# EAGLE design mcp23008_io_wing (EAGLE 9.6.0)
AUTHOR: Göran Mannnberg
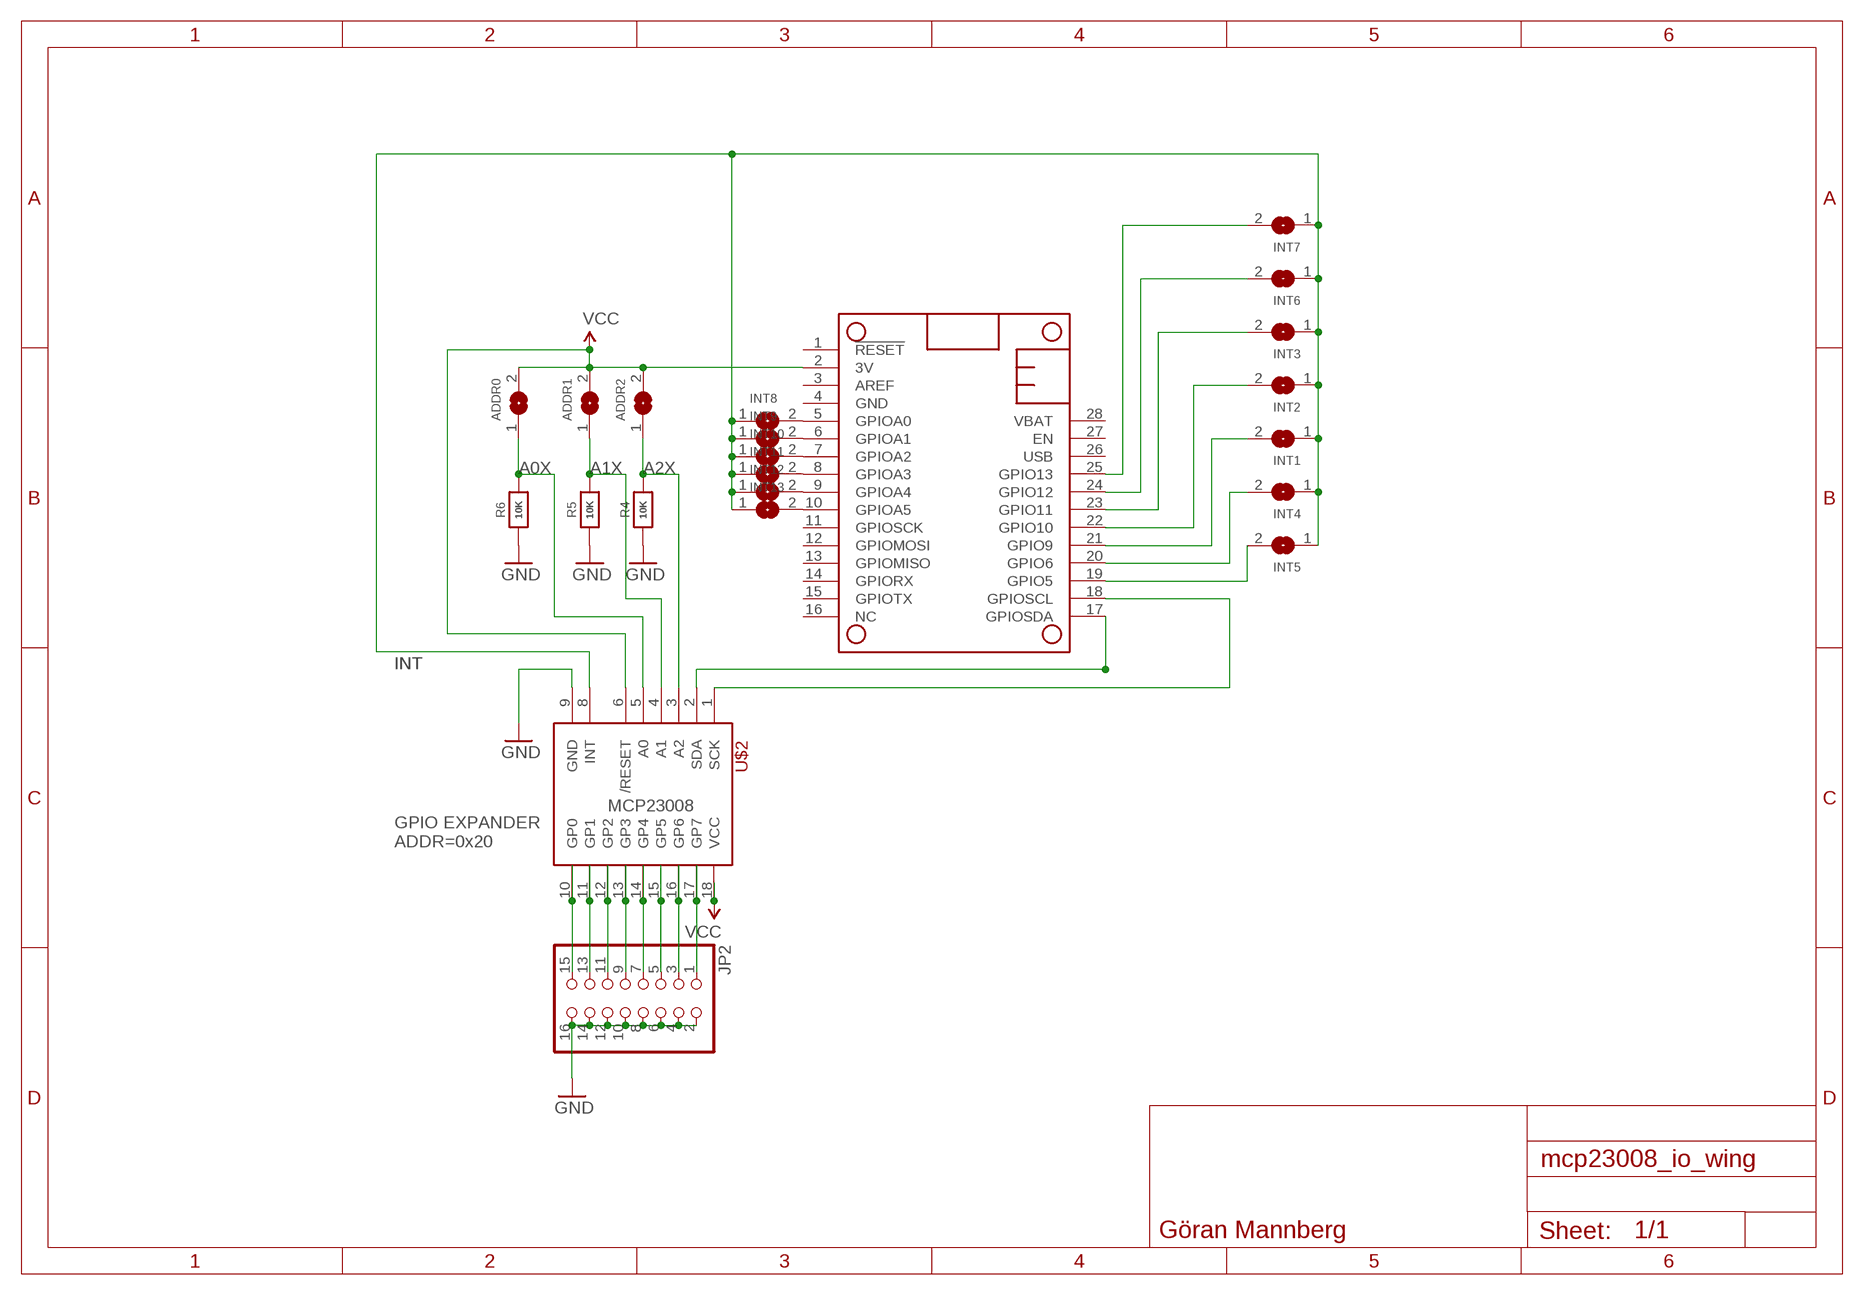
[diagram p0: schematic, sheet 1]

## Parts
ADDR0  SOLDERJUMPER  [SOLDERJUMPER_ARROW_NOPASTE]
ADDR1  SOLDERJUMPER  [SOLDERJUMPER_ARROW_NOPASTE]
ADDR2  SOLDERJUMPER  [SOLDERJUMPER_ARROW_NOPASTE]
INT1  SOLDERJUMPER  [SOLDERJUMPER_ARROW_NOPASTE]
INT2  SOLDERJUMPER  [SOLDERJUMPER_ARROW_NOPASTE]
INT3  SOLDERJUMPER  [SOLDERJUMPER_ARROW_NOPASTE]
INT4  SOLDERJUMPER  [SOLDERJUMPER_ARROW_NOPASTE]
INT5  SOLDERJUMPER  [SOLDERJUMPER_ARROW_NOPASTE]
INT6  SOLDERJUMPER  [SOLDERJUMPER_ARROW_NOPASTE]
INT7  SOLDERJUMPER  [SOLDERJUMPER_ARROW_NOPASTE]
INT8  SOLDERJUMPER  [SOLDERJUMPER_ARROW_NOPASTE]
INT9  SOLDERJUMPER  [SOLDERJUMPER_ARROW_NOPASTE]
INT10  SOLDERJUMPER  [SOLDERJUMPER_ARROW_NOPASTE]
INT11  SOLDERJUMPER  [SOLDERJUMPER_ARROW_NOPASTE]
INT12  SOLDERJUMPER  [SOLDERJUMPER_ARROW_NOPASTE]
INT13  SOLDERJUMPER  [SOLDERJUMPER_ARROW_NOPASTE]
JP2  HEADER-2X8_SHROUDED  [2X08_SHROUDED]
MS1  FEATHERWING  [FEATHERWING]
R4  10K  RESISTOR_0603_NOOUT  [0603-NO]
R5  10K  RESISTOR_0603_NOOUT  [0603-NO]
R6  10K  RESISTOR_0603_NOOUT  [0603-NO]
U$2  MCP23008  [SOIC-18-W-MAXIM]

## Nets
3V: ADDR0.2 ADDR1.2 ADDR2.2 MS1.2(3V) U$2.6(/RESET) U$2.18(VCC) ; supply symbol labelled VCC
A0X: ADDR0.1 R6.2 U$2.5(A0)
A1X: ADDR1.1 R5.2 U$2.4(A1)
A2X: ADDR2.1 R4.2 U$2.3(A2)
GND: JP2.2 JP2.4 JP2.6 JP2.8 JP2.10 JP2.12 JP2.14 JP2.16 R4.1 R5.1 R6.1 U$2.9(GND)
GPA0: JP2.1 U$2.17(GP7)
GPA1: JP2.3 U$2.16(GP6)
GPA2: JP2.5 U$2.15(GP5)
GPA3: JP2.7 U$2.14(GP4)
GPA4: JP2.9 U$2.13(GP3)
GPA5: JP2.11 U$2.12(GP2)
GPA6: JP2.13 U$2.11(GP1)
GPA7: JP2.15 U$2.10(GP0)
INT [New Class]: INT1.1 INT2.1 INT3.1 INT4.1 INT5.1 INT6.1 INT7.1 INT8.1 INT9.1 INT10.1 INT11.1 INT12.1 INT13.1 U$2.8(INT)
N$1: INT1.2 MS1.21(GPIO9)
N$2: INT2.2 MS1.22(GPIO10)
N$3: INT3.2 MS1.23(GPIO11)
N$4: INT6.2 MS1.24(GPIO12)
N$5: INT7.2 MS1.25(GPIO13)
N$6: INT8.2 MS1.5(GPIOA0)
N$7: INT5.2 MS1.19(GPIO5)
N$8: INT4.2 MS1.20(GPIO6)
N$9: INT9.2 MS1.6(GPIOA1)
N$10: INT10.2 MS1.7(GPIOA2)
N$11: INT11.2 MS1.8(GPIOA3)
N$12: INT12.2 MS1.9(GPIOA4)
N$13: INT13.2 MS1.10(GPIOA5)
SCL: MS1.18(GPIOSCL) U$2.1(SCK)
SDA: MS1.17(GPIOSDA) U$2.2(SDA)
Unconnected: MS1.1(!RESET) MS1.3(AREF) MS1.11(GPIOSCK) MS1.12(GPIOMOSI) MS1.13(GPIOMISO) MS1.14(GPIORX) MS1.15(GPIOTX) MS1.16(NC) MS1.26(USB) MS1.27(EN) MS1.28(VBAT)

## Notes on the sheet
- MCP23008
- GPIO EXPANDER
  ADDR=0x20
- Göran Mannberg

## Power pins joined to a net without a drawn wire
GND: MS1.4(GND)

## Library data of the parts
ADDR0 ADDR1 ADDR2 INT1-INT13 = microbuilder:SOLDERJUMPER: SMD Solder JUMPER Solder the two pads together to create a connection, or remove the solder to break it. REFLOW - Use this footprint for solder paste and reflow ovens. WAVE - Use this footprint for hand-soldering (larger pads). CLOSED - Has a trace between the two pads to ensure it is closed by default. The trace needs to be cut to disable the jumper, and can be closed again by creating a solder bridge between the two pads.; BOM: EXCLUDE
JP2 = microbuilder:HEADER-2X8
MS1 = microbuilder:FEATHERWING
R4-R6 = microbuilder:RESISTOR: Resistors For new designs, use the packages preceded by an '_' character since they are more reliable: The following footprints should be used on most boards: _0402 - Standard footprint for regular board layouts _0603 - Standard footprint for regular board layouts _0805 - Standard footprint for regular board layouts _1206 - Standard footprint for regular board layouts For extremely tight-pitch boards where space is at a premium, the following 'micro-pitch' footprints can be used (smaller pads, no silkscreen outline, etc.): _0402MP - Micro-pitch footprint for very dense/compact boards _0603MP - Micro-pitch footprint for very dense/compact boards _0805MP - Micro-pitch footprint for very dense/compact boards _1206MP - Micro-pitch footprint for very dense/compact boards
U$2 = rickk2:MCP23008: IC I/O EXPANDER I2C 8B 18SOIC $1.08 https://www.digikey.com/product-detail/en/microchip-technology/MCP23008T-E-SO/MCP23008T-E-SOCT-ND/5358243

## Board
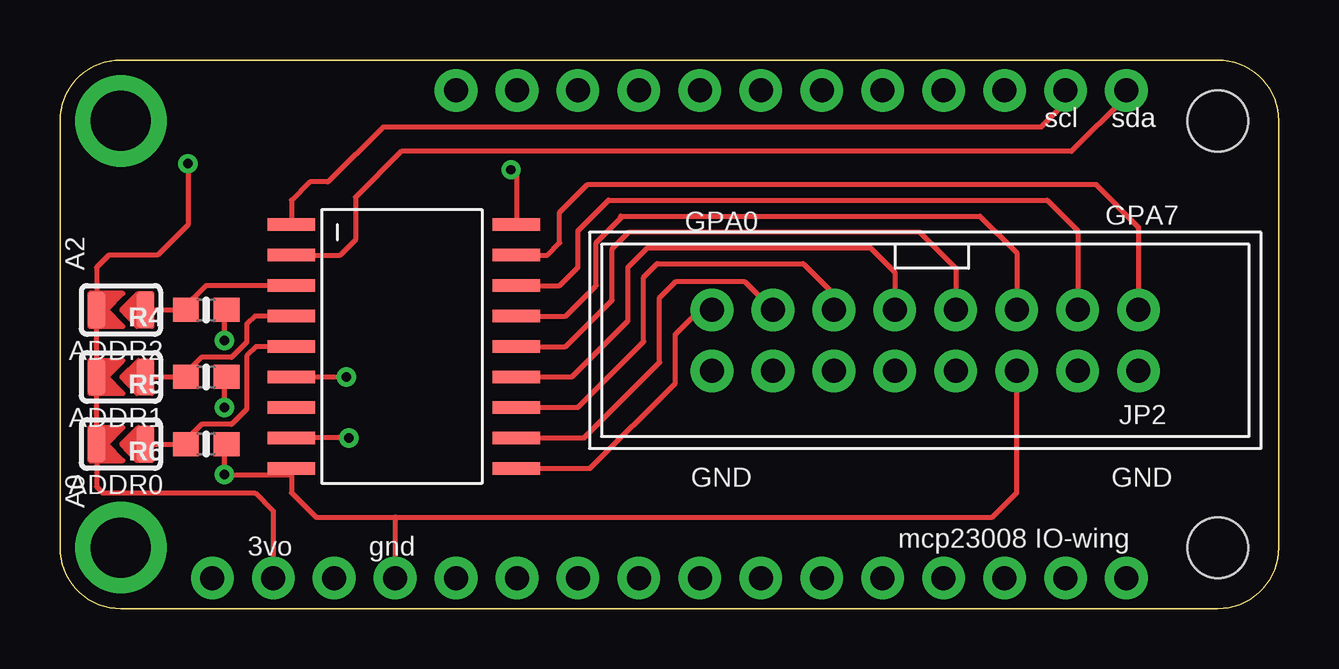
[diagram p1: board, top side]
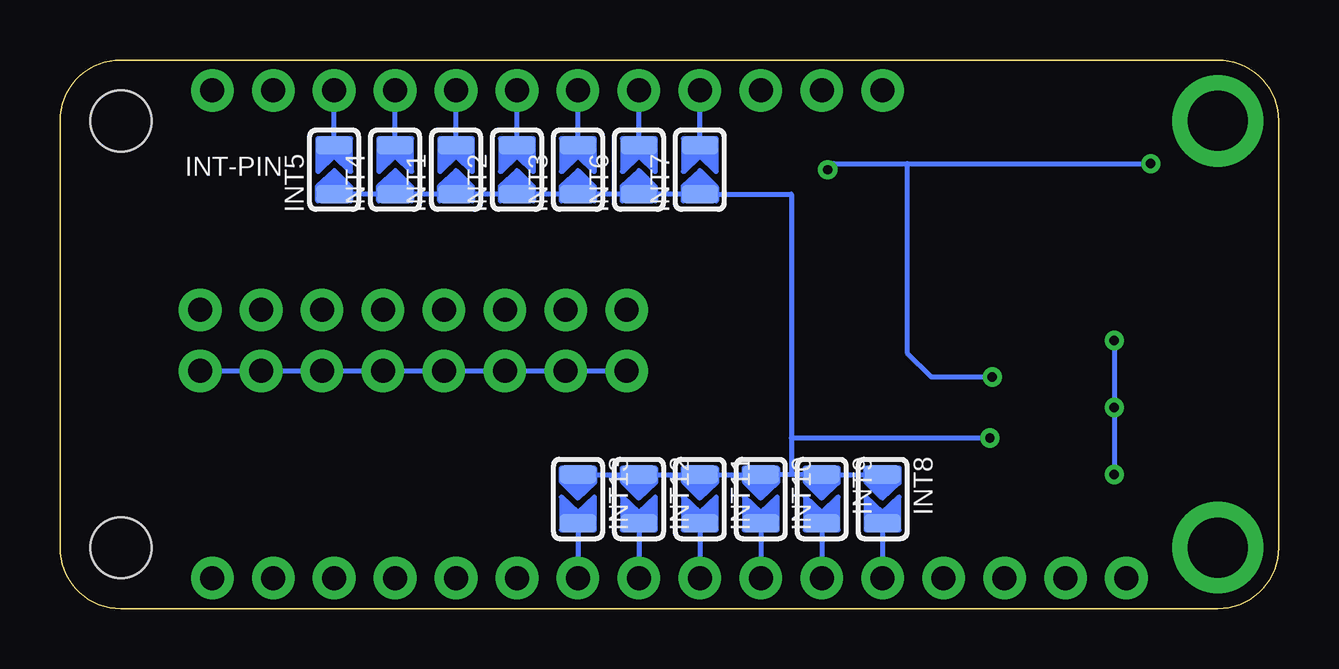
[diagram p2: board, bottom side, seen from below]

Size 50.8 x 22.86 mm. Coordinates in mm from the lower left corner, seen from the top.
Outline: 2.54,22.86 48.26,22.86 arc-90 50.8,20.32 50.8,2.54 arc-90 48.26,0 2.54,0 arc-90 0,2.54 0,20.32 arc-90 2.54,22.86
Copper layers (1*16): Top 0.035mm / dielectric 1.5mm / Bottom 0.035mm
Design rules "adafruit": minimum track width 8mil, minimum drill 15.5mil, track to track 8mil, track to pad 8mil, pad to pad 8mil, via to via 8mil, smd to smd 8mil, copper to edge 10mil, drill to drill 8mil, minimum pad ring 10mil, minimum via ring 8mil, stop-mask expansion 2mil, vias tented up to drill 20mil, thermal gap 10mil

### Footprints (pad centres in the part's own frame; a part is rotated, then mirrored left to right if it is on the bottom)
SOLDERJUMPER_ARROW_NOPASTE = smd 0.762 x 1.524: 1 -1.016,0; 2 1.016,0
2X08_SHROUDED = drill 1 pad 1.778: 1 -8.89,-1.27; 2 -8.89,1.27; 3 -6.35,-1.27; 4 -6.35,1.27; 5 -3.81,-1.27; 6 -3.81,1.27; 7 -1.27,-1.27; 8 -1.27,1.27; 9 1.27,-1.27; 10 1.27,1.27; 11 3.81,-1.27; 12 3.81,1.27; 13 6.35,-1.27; 14 6.35,1.27; 15 8.89,-1.27; 16 8.89,1.27
FEATHERWING = drill 1 pad 1.778: 1 6.35,1.27; 2 8.89,1.27; 3 11.43,1.27; 4 13.97,1.27; 5 16.51,1.27; 6 19.05,1.27; 7 21.59,1.27; 8 24.13,1.27; 9 26.67,1.27; 10 29.21,1.27; 11 31.75,1.27; 12 34.29,1.27; 13 36.83,1.27; 14 39.37,1.27; 15 41.91,1.27; 16 44.45,1.27; 17 44.45,21.59; 18 41.91,21.59; 19 39.37,21.59; 20 36.83,21.59; 21 34.29,21.59; 22 31.75,21.59; 23 29.21,21.59; 24 26.67,21.59; 25 24.13,21.59; 26 21.59,21.59; 27 19.05,21.59; 28 16.51,21.59 | drill 2.5 pad 3.81: P$1 2.54,20.32; P$2 2.54,2.54 | hole 2.54: 48.26,20.32; 48.26,2.54
0603-NO = smd 1.075 x 1: 1 -0.85,0; 2 0.85,0
SOIC-18-W-MAXIM = smd 0.533 x 1.981: 1 0,0; 2 1.27,0; 3 2.54,0; 4 3.81,0; 5 5.08,0; 6 6.35,0; 7 7.62,0; 8 8.89,0; 9 10.16,0; 10 10.16,9.373; 11 8.89,9.373; 12 7.62,9.373; 13 6.35,9.373; 14 5.08,9.373; 15 3.81,9.373; 16 2.54,9.373; 17 1.27,9.373; 18 0,9.373

### Placement (x,y rotation side)
ADDR0  2.54,6.86 180 top
ADDR1  2.54,9.65 180 top
ADDR2  2.54,12.45 180 top
INT1  34.29,18.29 90 bottom
INT2  31.75,18.29 90 bottom
INT3  29.21,18.29 90 bottom
INT4  36.83,18.29 90 bottom
INT5  39.37,18.29 90 bottom
INT6  26.67,18.29 90 bottom
INT7  24.13,18.29 90 bottom
INT8  16.51,4.57 270 bottom
INT9  19.05,4.57 270 bottom
INT10  21.59,4.57 270 bottom
INT11  24.13,4.57 270 bottom
INT12  26.67,4.57 270 bottom
INT13  29.21,4.57 270 bottom
JP2  36.07,11.18 180 top
MS1  0,0 0 top
R4  6.1,12.45 180 top
R5  6.1,9.65 180 top
R6  6.1,6.86 180 top
U$2  9.65,16 270 top

### Tracks (layer width: path | path; a pad name or v marks a point on that pad's centre or on a via)
3V  (via drill 0.39)
  Top 0.203: MS1.2 8.89,4.06 8.13,4.83 1.78,4.83 1.52,5.08 ADDR0.2 ADDR1.2 ADDR2.2 1.52,14.22 2.03,14.73 4.06,14.73 5.33,16 v5.33,18.54 5.25,18.45 | v18.8,18.29 19.02,18.06 U$2.18 | U$2.6 v11.94,9.65
  Bottom 0.203: 15.49,18.54 18.54,18.54 v18.8,18.29 | 15.49,18.54 v5.33,18.54 | 15.49,18.54 15.49,10.67 14.48,9.65 v11.94,9.65 11.63,9.65
A0X
  Top 0.203: ADDR0.1 5.08,6.86 | 5.08,6.86 R6.2 | U$2.5 8.18,10.92 7.79,10.54 7.79,8.31 7.15,7.68 5.9,7.68 5.08,6.86
A1X
  Top 0.203: ADDR1.1 5.08,9.65 | 5.08,9.65 R5.2 | U$2.4 8.13,12.19 7.79,11.85 7.79,11.11 7.15,10.47 5.9,10.47 5.08,9.65
A2X
  Top 0.203: ADDR2.1 5.08,12.45 | 5.08,12.45 R4.2 | U$2.3 6.1,13.46 5.08,12.45
GND  (via drill 0.39)
  Top 0.203: U$2.9 9.65,5.59 | 9.65,5.59 9.65,4.83 10.67,3.81 13.97,3.81 | v6.86,11.18 6.86,12.36 R4.1 | v6.86,8.38 6.86,9.56 R5.1 | R6.1 6.86,6.77 v6.86,5.59 9.65,5.59 | 13.97,3.81 MS1.4 | 13.97,3.81 38.86,3.81 39.88,4.83 JP2.6
  Bottom 0.203: JP2.2 JP2.4 JP2.6 JP2.8 JP2.10 JP2.12 JP2.14 JP2.16 | v6.86,11.18 v6.86,8.38 v6.86,5.59
GPA0
  Top 0.203: U$2.17 20.32,14.73 20.83,15.24 20.83,16.51 22,17.68 43.18,17.68 44.96,15.9 JP2.1
GPA1
  Top 0.203: U$2.16 20.83,13.46 21.59,14.22 21.59,15.75 22.86,17.02 41.15,17.02 42.42,15.75 JP2.3
GPA2
  Top 0.203: U$2.15 21.08,12.19 22.35,13.46 22.35,15.24 23.37,16.26 23.37,16.36 38.35,16.36 39.88,14.83 JP2.5
GPA3
  Top 0.203: U$2.14 21.08,10.92 23.01,12.85 23.01,14.99 23.72,15.7 35.81,15.7 37.34,14.17 JP2.7
GPA4
  Top 0.203: U$2.13 21.34,9.65 23.67,11.99 23.67,14.22 24.49,15.04 33.78,15.04 34.8,14.02 JP2.9
GPA5
  Top 0.203: U$2.12 21.59,8.38 24.33,11.12 24.33,13.82 24.89,14.38 30.99,14.38 32.26,13.11 JP2.11
GPA6
  Top 0.203: U$2.11 21.84,7.11 24.99,10.26 24.99,12.95 25.68,13.64 28.52,13.64 JP2.13
GPA7
  Top 0.203: U$2.10 22.1,5.84 25.65,9.4 25.65,11.43 26.67,12.45 JP2.15
INT  (via drill 0.39)
  Top 0.203: v12.04,7.11 U$2.8
  Bottom 0.203: 20.32,7.11 20.32,17.27 INT7.1 INT6.1 INT3.1 INT2.1 INT1.1 INT4.1 INT5.1 | 20.32,7.11 v12.04,7.11 | INT8.1 INT9.1 20.32,5.59 | 20.32,5.59 INT10.1 INT11.1 INT12.1 INT13.1 | 20.32,7.11 20.32,5.59
N$1
  Bottom 0.203: INT1.2 MS1.21
N$2
  Bottom 0.203: INT2.2 MS1.22
N$3
  Bottom 0.203: INT3.2 MS1.23
N$4
  Bottom 0.203: INT6.2 MS1.24
N$5
  Bottom 0.203: INT7.2 MS1.25
N$6
  Bottom 0.203: INT8.2 MS1.5
N$7
  Bottom 0.203: INT5.2 MS1.19
N$8
  Bottom 0.203: INT4.2 MS1.20
N$9
  Bottom 0.203: INT9.2 MS1.6
N$10
  Bottom 0.203: INT10.2 MS1.7
N$11
  Bottom 0.203: INT11.2 MS1.8
N$12
  Bottom 0.203: INT12.2 MS1.9
N$13
  Bottom 0.203: INT13.2 MS1.10
SCL
  Top 0.203: 8.89,16 U$2.1 9.65,17.02 10.41,17.78 11.18,17.78 13.46,20.07 40.89,20.07 41.91,21.08 MS1.18
SDA
  Top 0.203: U$2.2 11.68,14.73 12.32,15.37 12.32,17.14 14.22,19.05 42.16,19.05 44.45,21.34 MS1.17

### Text on the board
tPlace: scl | sda | GPA0 | GPA7 | A2 | GND | GND | A0 | mcp23008 IO-wing | 3vo | gnd
bPlace: INT-PIN